# Altium schematic sheet Cover Sheet.SchDoc: Cover Sheet
size A3; SheetNumber: 1
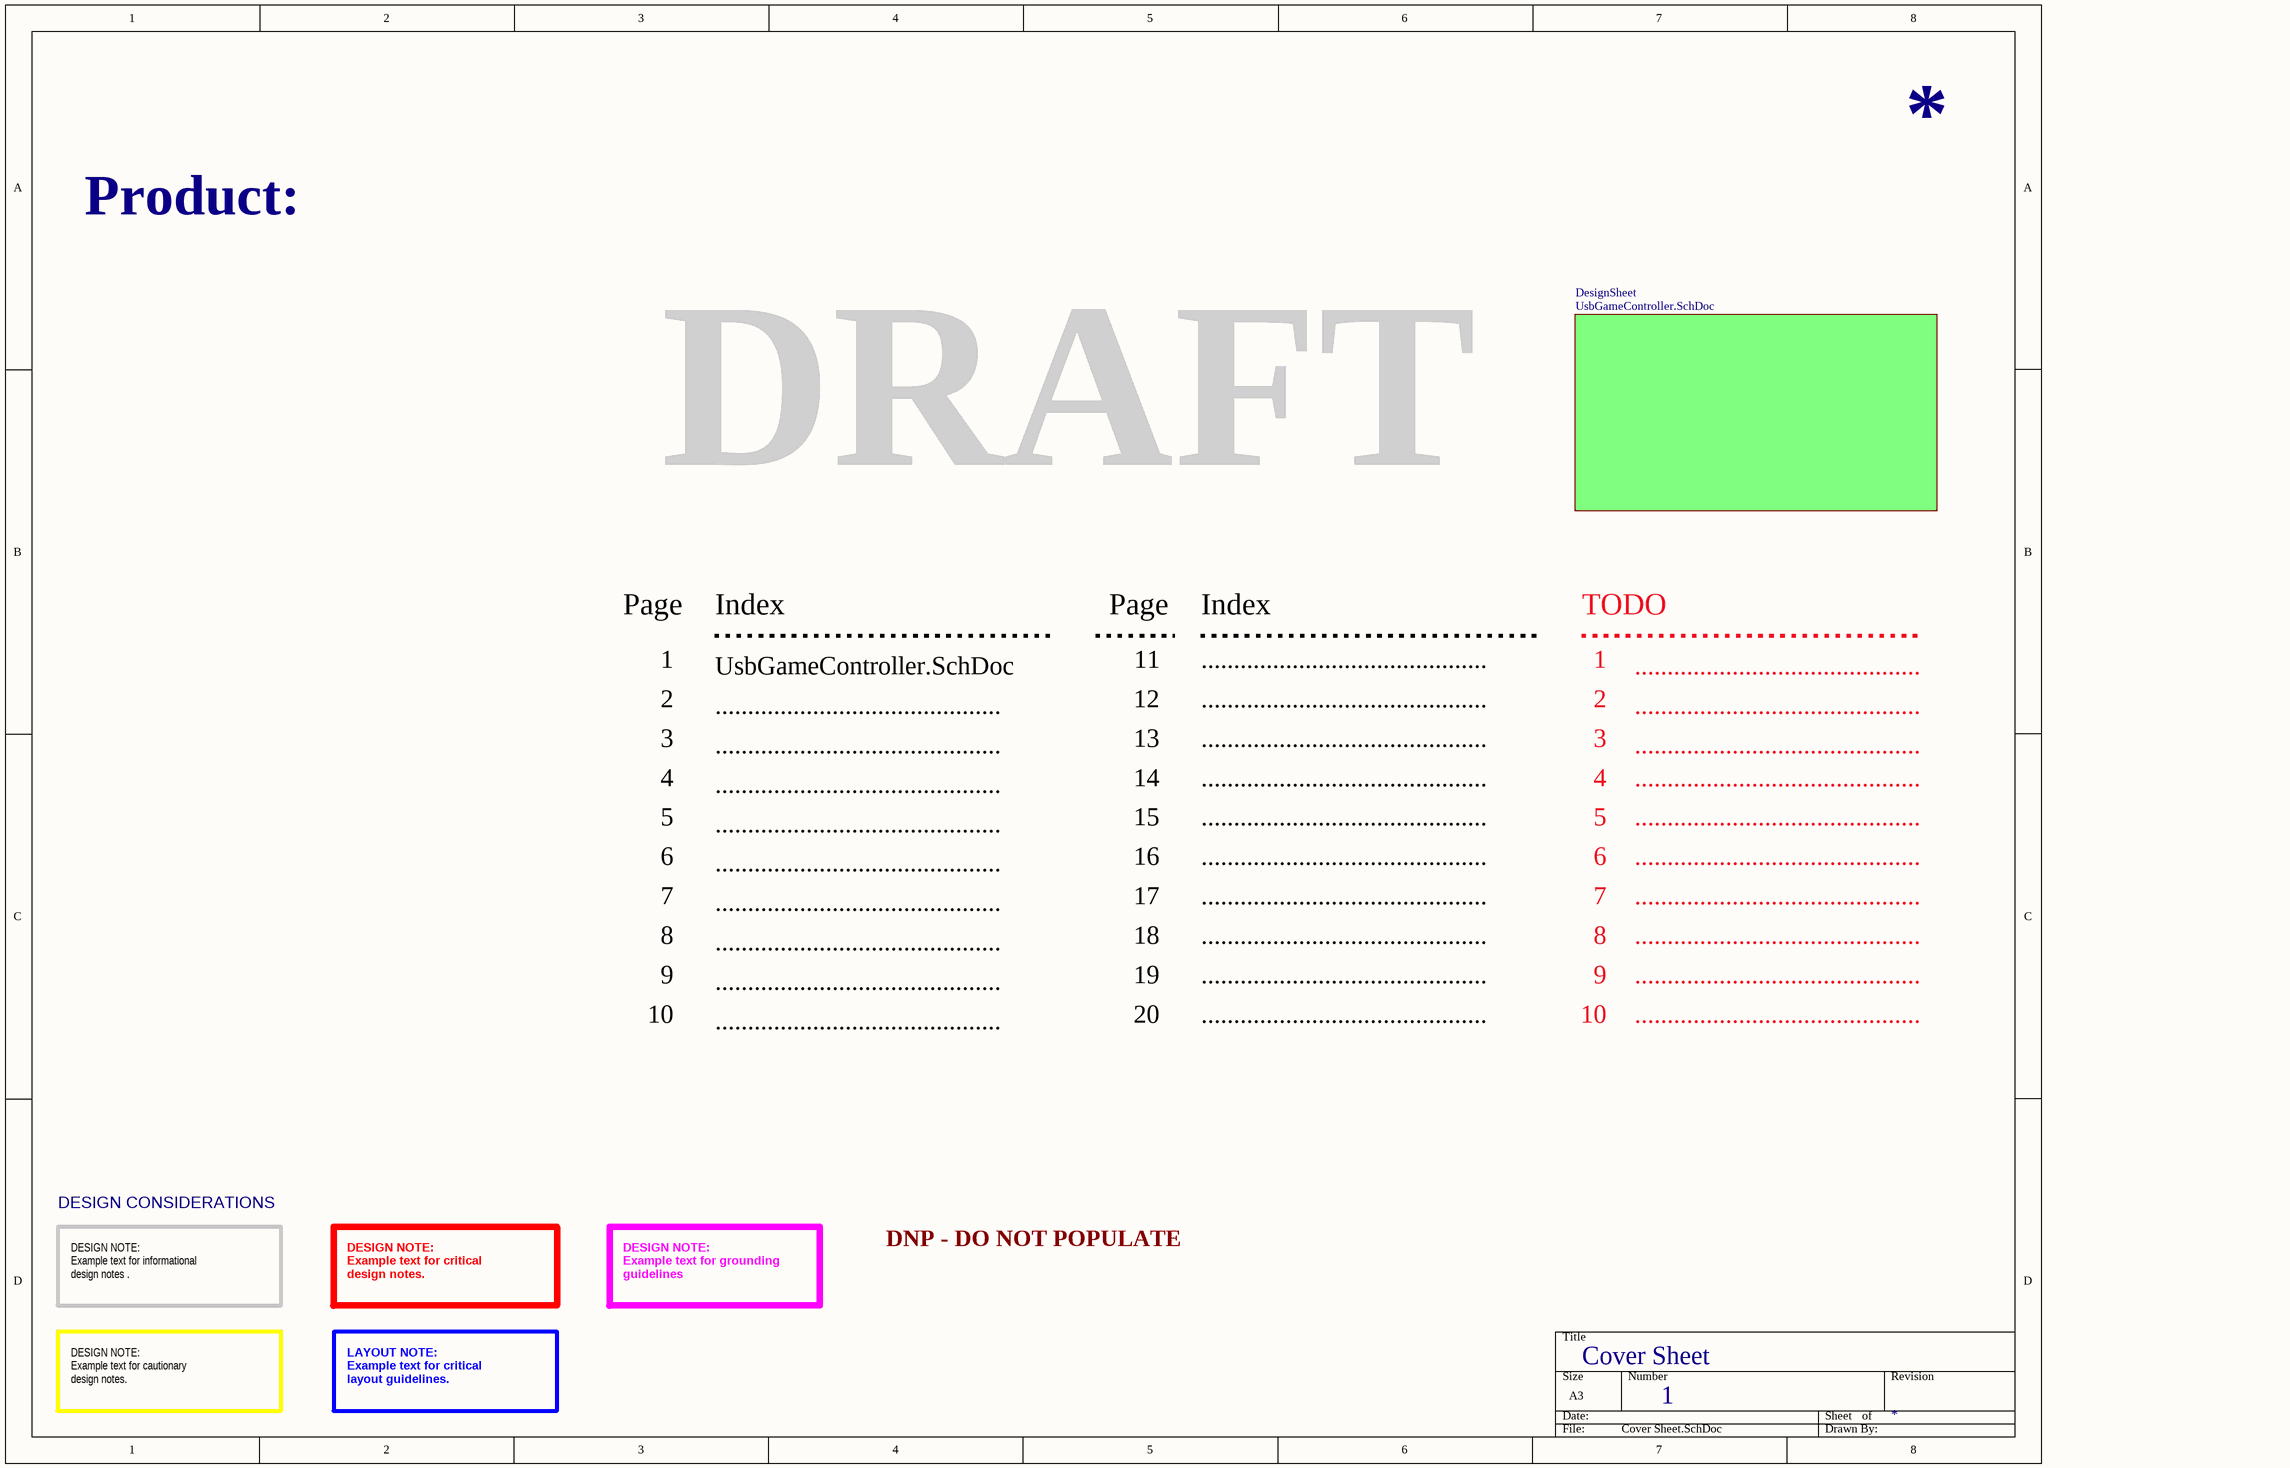
[diagram p0: Cover Sheet.SchDoc]

## Sub-sheets
DesignSheet = UsbGameController.SchDoc: no entries

## Notes on the sheet
- Product:
- DRAFT
- Page
- Index
- TODO
- 1
- UsbGameController.SchDoc
- 11
- ............................................
- 2
- 3
- 12
- 13
- 4
- 5
- 14
- 15
- 6
- 16
- 7
- 8
- 17
- 18
- 9
- 10
- 19
- 20
- DESIGN CONSIDERATIONS
- DNP - DO NOT POPULATE
- DESIGN NOTE:
  Example text for informational
  design notes .
- DESIGN NOTE:
  Example text for critical
  design notes.
- DESIGN NOTE:
  Example text for grounding guidelines
- DESIGN NOTE:
  Example text for cautionary
  design notes.
- LAYOUT NOTE:
  Example text for critical
  layout guidelines.